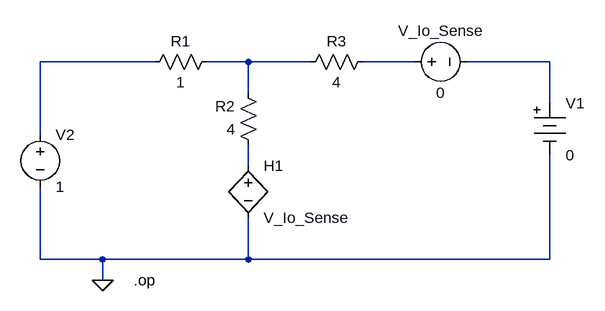
[diagram p0: schematic g3_p18_Rth.asc]
g3_p18_Rth.asc, the LTspice schematic file:
Version 4
SHEET 1 880 680
WIRE 16 96 -160 96
WIRE 160 96 96 96
WIRE 256 96 160 96
WIRE 416 96 336 96
WIRE 624 96 496 96
WIRE 160 144 160 96
WIRE 624 160 624 96
WIRE -160 208 -160 96
WIRE 160 256 160 224
WIRE -160 400 -160 288
WIRE -64 400 -160 400
WIRE 160 400 160 336
WIRE 160 400 -64 400
WIRE 624 400 624 240
WIRE 624 400 160 400
WIRE -64 432 -64 400
FLAG -64 432 0
SYMBOL res 112 80 R90
WINDOW 0 0 56 VBottom 2
WINDOW 3 32 56 VTop 2
SYMATTR InstName R1
SYMATTR Value 1
SYMBOL res 176 240 R180
WINDOW 0 36 76 Left 2
WINDOW 3 36 40 Left 2
SYMATTR InstName R2
SYMATTR Value 4
SYMBOL res 240 112 R270
WINDOW 0 32 56 VTop 2
WINDOW 3 0 56 VBottom 2
SYMATTR InstName R3
SYMATTR Value 4
SYMBOL Misc\\battery 624 144 R0
WINDOW 123 0 0 Left 0
WINDOW 39 0 0 Left 0
SYMATTR InstName V1
SYMATTR Value 0
SYMBOL h 160 240 R0
SYMATTR InstName H1
SYMATTR Value V_Io_Sense
SYMATTR Value2 3
SYMBOL voltage 400 96 R270
WINDOW 0 32 56 VTop 2
WINDOW 3 -32 56 VBottom 2
SYMATTR InstName V_Io_Sense
SYMATTR Value 0
SYMBOL voltage -160 192 R0
WINDOW 123 0 0 Left 0
WINDOW 39 0 0 Left 0
SYMATTR InstName V2
SYMATTR Value 1
TEXT -16 432 Left 2 !.op

The netlist it stands for:
* g3_p18_Rth.asc
R1 N002 N001 1
R2 N005 N002 4
R3 N002 N003 4
V1 N004 0 0
H1 N005 0 V_Io_Sense 3
V_Io_Sense N003 N004 0
V2 N001 0 1
.op
.backanno
.end